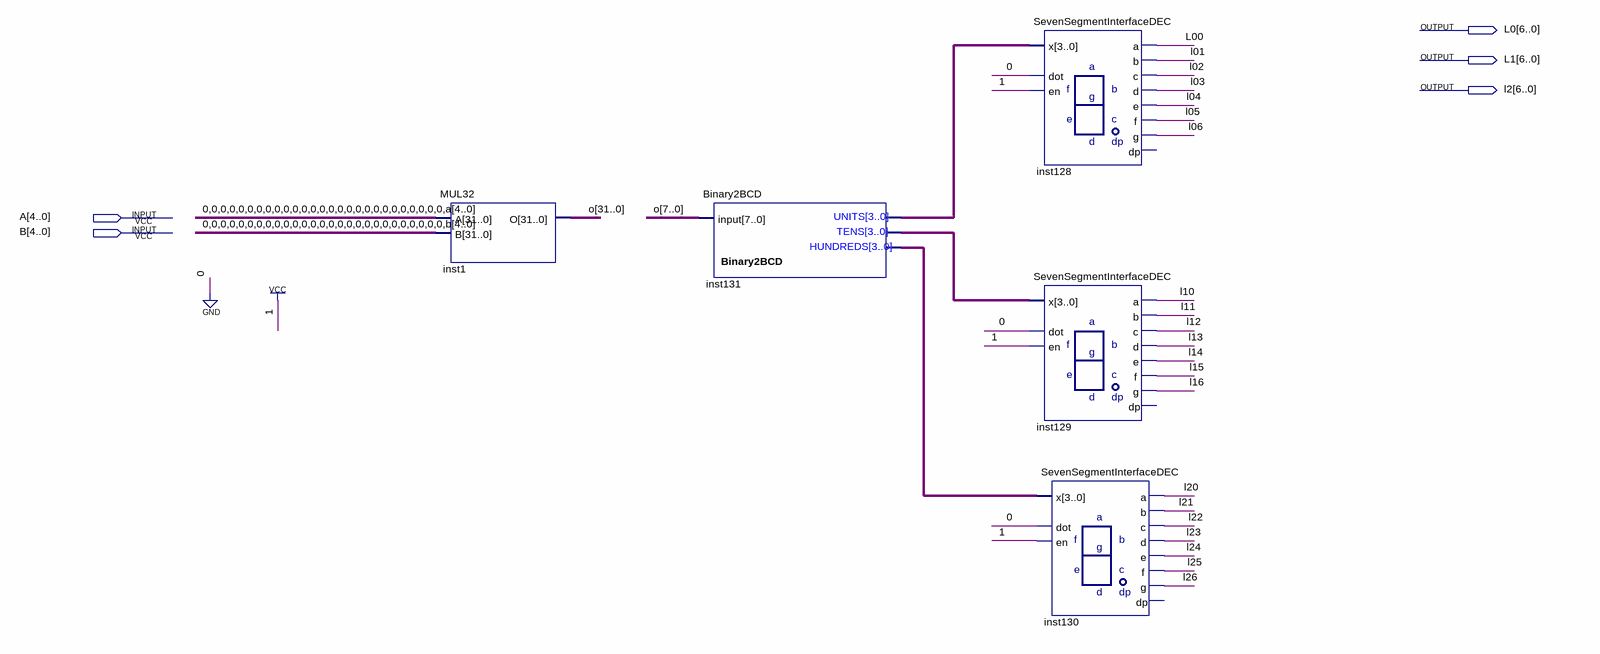
[diagram p0: schematic sheet]
// Quartus schematic MUL32test.bdf as structural Verilog: 5 symbols, 5 pins
module MUL32test (
  input  [4:0] A,
  input  [4:0] B,
  output [6:0] L0,
  output [6:0] L1,
  output [6:0] l2
);

  wire [3:0] inst131_bcd_hundreds, inst131_bcd_tens, inst131_bcd_units;
  wire [31:0] o;

  MUL32 inst1 (.A({{27{1'b0}}, A}), .B({{27{1'b0}}, B}), .O(o));
  Binary2BCD inst131 (
    .\input (o[7:0]), .bcd_hundreds(inst131_bcd_hundreds), .bcd_tens(inst131_bcd_tens),
    .bcd_units(inst131_bcd_units));
  SevenSegmentInterfaceDEC inst128 (
    .dot(1'b0), .en(1'b1), .x(inst131_bcd_units), .a(L0[0]), .b(L0[1]), .c(L0[2]), .d(L0[3]), .e(L0[4]),
    .f(L0[5]), .g(L0[6]));  // open: dp
  SevenSegmentInterfaceDEC inst129 (
    .dot(1'b0), .en(1'b1), .x(inst131_bcd_tens), .a(L1[0]), .b(L1[1]), .c(L1[2]), .d(L1[3]), .e(L1[4]),
    .f(L1[5]), .g(L1[6]));  // open: dp
  SevenSegmentInterfaceDEC inst130 (
    .dot(1'b0), .en(1'b1), .x(inst131_bcd_hundreds), .a(l2[0]), .b(l2[1]), .c(l2[2]), .d(l2[3]), .e(l2[4]),
    .f(l2[5]), .g(l2[6]));  // open: dp
endmodule
